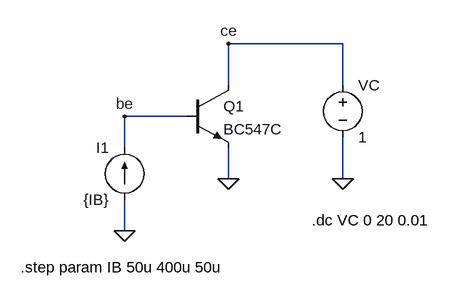
[diagram p0: schematic bc547_curves.asc]
bc547_curves.asc, the LTspice schematic file:
Version 4.1
SHEET 1 880 680
WIRE 304 48 128 48
WIRE 128 112 128 48
WIRE 304 112 304 48
WIRE 64 160 -32 160
WIRE -32 208 -32 160
WIRE 128 256 128 208
WIRE 304 256 304 192
WIRE -32 336 -32 288
FLAG 304 256 0
FLAG 128 256 0
FLAG -32 336 0
FLAG -32 160 be
FLAG 128 48 ce
SYMBOL npn 64 112 R0
SYMATTR InstName Q1
SYMATTR Value BC547C
SYMBOL voltage 304 96 R0
WINDOW 123 0 0 Left 0
WINDOW 39 0 0 Left 0
SYMATTR InstName VC
SYMATTR Value 1
SYMBOL current -32 288 R180
WINDOW 0 24 80 Left 2
WINDOW 3 24 0 Left 2
WINDOW 123 0 0 Left 0
WINDOW 39 0 0 Left 0
SYMATTR InstName I1
SYMATTR Value {IB}
TEXT -192 392 Left 2 !.step param IB 50u 400u 50u
TEXT 256 320 Left 2 !.dc VC 0 20 0.01

The netlist it stands for:
* bc547_curves.asc
Q1 ce be 0 0 BC547C
VC ce 0 1
I1 0 be {IB}
.model NPN NPN
.model PNP PNP
.lib standard.bjt
.step param IB 50u 400u 50u
.dc VC 0 20 0.01
.backanno
.end